# Altium project StratoChovy.PrjPcb (part 1 of 2)
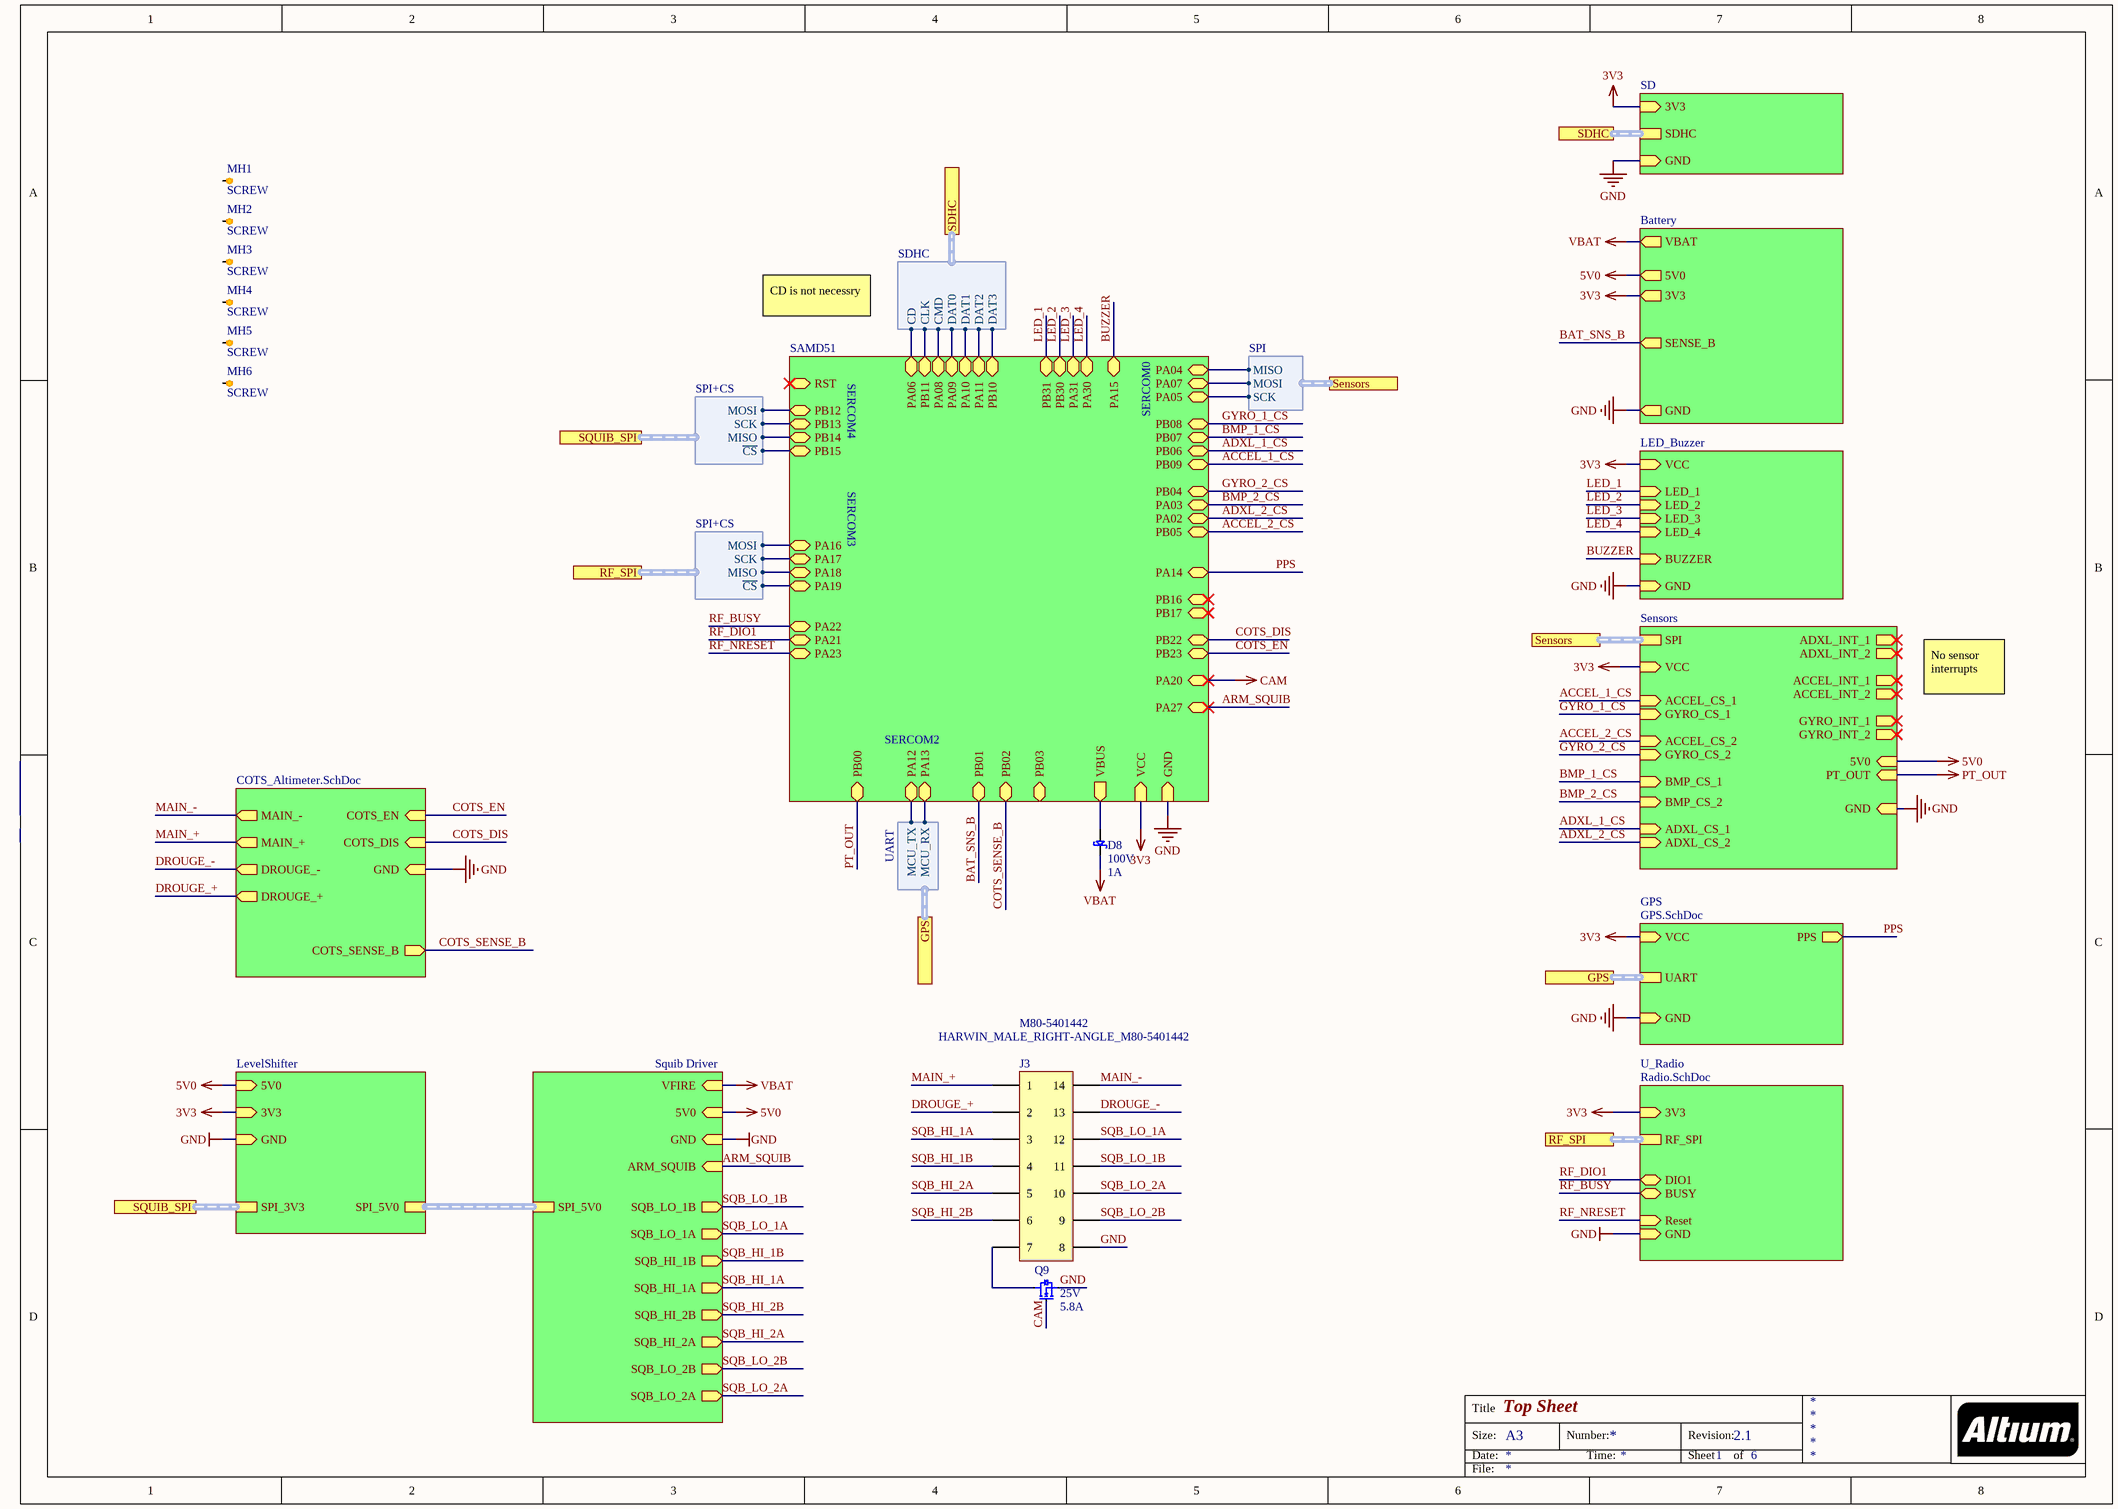
[diagram p0: StratoChovy.SchDoc]
prjEngineer1: Tim Vrakas; prjReviewDate: 2019-08-03; prjRevision: 1; prjTitle: ThunderGuppy
11 sheets, 166 parts. Net scope: strictly hierarchical (ports join the sheet entries above them; power ports are local).
Board files: Stratochovy2.PcbDoc, StratoChovy.PcbDoc
Sheets:
  StratoChovy.SchDoc
    Sensors = Sensors.SchDoc
    Battery = Battery_Management.SchDoc
    LED_Buzzer = Blink_Blink_Beep_Boop.SchDoc
    SAMD51 = SAMD51.SchDoc
    SD = SD.SchDoc
    GPS = GPS.SchDoc
    COTS_Altimeter = COTS_Altimeter.SchDoc
    U_Radio = Radio.SchDoc
    Squib Driver = MC33797.SchDoc
    LevelShifter = LevelShifter.SchDoc

## Sheet StratoChovy.SchDoc: Top Sheet
size A3; Author: Tim Vrakas; CompanyName: SSI; Revision: 2.1; SheetNumber: 1; SheetTotal: 6; DocumentName: Top Sheet

### Parts
D8  Voltage - DC Reverse (Vr) (Max): 100V  Current - Average Rectified (Io): 1A  [SMA]  (hidden comment: Diode_CD214A-B1100LF)
J3  HARWIN_MALE_RIGHT-ANGLE_M80-5401442  Manufacturer Part Number: M80-5401442  [HARWIN_M80-5401442]
MH1  SCREW  [SCREW_M3]
MH2  SCREW  [SCREW_M3]
MH3  SCREW  [SCREW_M3]
MH4  SCREW  [SCREW_M3]
MH5  SCREW  [SCREW_M3]
MH6  SCREW  [SCREW_M3]
Q9  Drain to Source Voltage (Vdss): 25V  Current - Continuous Drain (Id) @ 25° C: 5.8A  [3SOT23]  (hidden comment: NFET_IRFML8244TRPBF)

### Sub-sheets
Battery = Battery_Management: GND (out), 3V3 (out), VBAT (out), SENSE_B (out), 5V0 (out)
COTS_Altimeter = COTS_Altimeter.SchDoc: COTS_EN (in), COTS_DIS (in), GND (in), MAIN_- (out), MAIN_+ (out), DROUGE_- (out), DROUGE_+ (out), COTS_SENSE_B (out)
GPS = GPS.SchDoc: UART (harness UART), VCC (in), GND (in), PPS (out)
LED_Buzzer = Blink_Blink_Beep_Boop: LED_1 (in), LED_2 (in), LED_3 (in), LED_4 (in), BUZZER (in), GND (in), VCC (in)
LevelShifter = LevelShifter.SchDoc: SPI_3V3 (harness SPI+CS), SPI_5V0 (harness SPI+CS), 3V3 (in), 5V0 (in), GND (in)
SAMD51 = SAMD51.SchDoc: PA12 (bidir), PA13 (bidir), PA05 (bidir), PA07 (bidir), PA04 (bidir), PA06 (bidir), PB11 (bidir), PA08 (bidir), PA09 (bidir), PA10 (bidir), PA11 (bidir), PB10 (bidir), PB12 (bidir), PB13 (bidir), PA22 (bidir), PA23 (bidir), PA19 (bidir), PA17 (bidir), PA21 (bidir), PB08 (bidir), PB07 (bidir), PB06 (bidir), PB09 (bidir), PB04 (bidir), PA03 (bidir), PA02 (bidir), PB05 (bidir), PB30 (bidir), PA31 (bidir), PA30 (bidir), PB31 (bidir), PB16 (bidir), PA14 (bidir), PB17 (bidir), PB23 (bidir), PB22 (bidir), PB02 (bidir), PB03 (bidir), PA18 (bidir), GND (in), VCC (in), VBUS (out), PB14 (bidir), PB15 (bidir), PA15 (bidir), RST (bidir), PA16 (bidir), PB01 (bidir), PB00 (bidir), PA20 (bidir), PA27 (bidir)
SD = SD.SchDoc: SDHC (harness SDHC), GND (in), 3V3 (in)
Sensors = Sensors.SchDoc: SPI (harness SPI), GYRO_CS_1 (in), BMP_CS_1 (in), ADXL_CS_1 (in), ACCEL_CS_1 (in), ACCEL_INT_1 (out), ACCEL_INT_2 (out), ADXL_INT_1 (out), GYRO_INT_1 (out), GYRO_INT_2 (out), GND (in), VCC (in), GYRO_CS_2 (in), ACCEL_CS_2 (in), BMP_CS_2 (in), ADXL_CS_2 (in), ADXL_INT_2 (out), 5V0 (in), PT_OUT (in)
Squib Driver = MC33797.SchDoc: VFIRE (in), SPI_5V0 (harness SPI+CS), GND (in), 5V0 (in), SQB_HI_2B (out), SQB_LO_1B (out), SQB_LO_1A (out), SQB_HI_1B (out), SQB_HI_1A (out), SQB_HI_2A (out), SQB_LO_2B (out), SQB_LO_2A (out), ARM_SQUIB (in)
U_Radio = Radio.SchDoc: DIO1 (bidir), Reset (in), RF_SPI (harness SPI+CS), 3V3 (in), GND (in), BUSY (bidir)

### Ports
GPS (harness UART), RF_SPI (harness SPI+CS), SDHC (harness SDHC), Sensors (harness SPI), SQUIB_SPI (harness SPI+CS)

### Harnesses
UART: MCU_TX, MCU_RX
SPI: MISO, MOSI, SCK
SDHC: CD, CLK, CMD, DAT0, DAT1, DAT2, DAT3
SPI+CS: MOSI, SCK, MISO, ~{CS}

### Nets
3V3: sheet Sensors/VCC, sheet Battery/3V3, sheet LED_Buzzer/VCC, sheet SAMD51/VCC, sheet SD/3V3, sheet GPS/VCC, sheet U_Radio/3V3, sheet LevelShifter/3V3
5V0: sheet Sensors/5V0, sheet Battery/5V0, sheet Squib Driver/5V0, sheet LevelShifter/5V0
CAM: Q9.1 ; sheet SAMD51/PA20
GND: J3.8 Q9.2 ; sheet Sensors/GND, sheet Battery/GND, sheet LED_Buzzer/GND, sheet SAMD51/GND, sheet SD/GND, sheet GPS/GND, sheet COTS_Altimeter/GND, sheet U_Radio/GND, sheet Squib Driver/GND, sheet LevelShifter/GND
PT_OUT: sheet Sensors/PT_OUT, sheet SAMD51/PB00
VBAT: D8.2(Cathode) ; sheet Battery/VBAT, sheet Squib Driver/VFIRE
VBUS: D8.1(Anode) ; sheet SAMD51/VBUS
ACCEL_1_CS: sheet Sensors/ACCEL_CS_1, sheet SAMD51/PB09
ACCEL_2_CS: sheet Sensors/ACCEL_CS_2, sheet SAMD51/PB05
ADXL_1_CS: sheet Sensors/ADXL_CS_1, sheet SAMD51/PB06
ADXL_2_CS: sheet Sensors/ADXL_CS_2, sheet SAMD51/PA02
ARM_SQUIB: sheet SAMD51/PA27, sheet Squib Driver/ARM_SQUIB
BAT_SNS_B: sheet Battery/SENSE_B, sheet SAMD51/PB01
BMP_1_CS: sheet Sensors/BMP_CS_1, sheet SAMD51/PB07
BMP_2_CS: sheet Sensors/BMP_CS_2, sheet SAMD51/PA03
BUZZER: sheet LED_Buzzer/BUZZER, sheet SAMD51/PA15
COTS_DIS: sheet SAMD51/PB22, sheet COTS_Altimeter/COTS_DIS
COTS_EN: sheet SAMD51/PB23, sheet COTS_Altimeter/COTS_EN
COTS_SENSE_B: sheet SAMD51/PB02, sheet COTS_Altimeter/COTS_SENSE_B
DROUGE_+: J3.2 ; sheet COTS_Altimeter/DROUGE_+
DROUGE_-: J3.13 ; sheet COTS_Altimeter/DROUGE_-
GPS_RX: sheet SAMD51/PA12, port GPS.MCU_TX
GPS_TX: sheet SAMD51/PA13, port GPS.MCU_RX
GYRO_1_CS: sheet Sensors/GYRO_CS_1, sheet SAMD51/PB08
GYRO_2_CS: sheet Sensors/GYRO_CS_2, sheet SAMD51/PB04
LED_1: sheet LED_Buzzer/LED_1, sheet SAMD51/PB31
LED_2: sheet LED_Buzzer/LED_2, sheet SAMD51/PB30
LED_3: sheet LED_Buzzer/LED_3, sheet SAMD51/PA31
LED_4: sheet LED_Buzzer/LED_4, sheet SAMD51/PA30
MAIN_+: J3.1 ; sheet COTS_Altimeter/MAIN_+
MAIN_-: J3.14 ; sheet COTS_Altimeter/MAIN_-
MISO: sheet SAMD51/PA04, port Sensors.MISO
MOSI: sheet SAMD51/PA07, port Sensors.MOSI
PPS: sheet SAMD51/PA14, sheet GPS/PPS
RF_BUSY: sheet SAMD51/PA22, sheet U_Radio/BUSY
RF_DIO1: sheet SAMD51/PA21, sheet U_Radio/DIO1
RF_NRESET: sheet SAMD51/PA23, sheet U_Radio/Reset
SCK: sheet SAMD51/PA05, port Sensors.SCK
SD_CD: sheet SAMD51/PA06, port SDHC.CD
SD_CLK: sheet SAMD51/PB11, port SDHC.CLK
SD_CMD: sheet SAMD51/PA08, port SDHC.CMD
SD_DAT0: sheet SAMD51/PA09, port SDHC.DAT0
SD_DAT1: sheet SAMD51/PA10, port SDHC.DAT1
SD_DAT2: sheet SAMD51/PA11, port SDHC.DAT2
SD_DAT3: sheet SAMD51/PB10, port SDHC.DAT3
SQB_HI_1A: J3.3 ; sheet Squib Driver/SQB_HI_1A
SQB_HI_1B: J3.4 ; sheet Squib Driver/SQB_HI_1B
SQB_HI_2A: J3.5 ; sheet Squib Driver/SQB_HI_2A
SQB_HI_2B: J3.6 ; sheet Squib Driver/SQB_HI_2B
SQB_LO_1A: J3.12 ; sheet Squib Driver/SQB_LO_1A
SQB_LO_1B: J3.11 ; sheet Squib Driver/SQB_LO_1B
SQB_LO_2A: J3.10 ; sheet Squib Driver/SQB_LO_2A
SQB_LO_2B: J3.9 ; sheet Squib Driver/SQB_LO_2B
NetJ3_7: J3.7 Q9.3
NetU13_25: sheet SAMD51/PB12, port SQUIB_SPI.MOSI
NetU13_26: sheet SAMD51/PB13, port SQUIB_SPI.SCK
NetU13_27: sheet SAMD51/PB14, port SQUIB_SPI.MISO
NetU13_28: sheet SAMD51/PB15, port SQUIB_SPI.~{CS}
NetU13_35: sheet SAMD51/PA16, port RF_SPI.MOSI
NetU13_36: sheet SAMD51/PA17, port RF_SPI.SCK
NetU13_37: sheet SAMD51/PA18, port RF_SPI.MISO
NetU13_38: sheet SAMD51/PA19, port RF_SPI.~{CS}

Not connected (* = marked no-connect by the designer): MH1 1; MH2 1; MH3 1; MH4 1; MH5 1; MH6 1

### Buses and harness runs
harness port GPS = sheet GPS/UART
harness port RF_SPI = sheet U_Radio/RF_SPI
harness port SDHC = sheet SD/SDHC
harness port Sensors = sheet Sensors/SPI
harness port SQUIB_SPI = sheet LevelShifter/SPI_3V3
harness sheet LevelShifter/SPI_5V0 = sheet Squib Driver/SPI_5V0

### Notes on the sheet
- CD is not necessry
- SERCOM4
- SERCOM0
- SERCOM3
- No sensor interrupts
- SERCOM2
- Title
- Size:
- Date:
- A3
- Number:
- Time:
- Revision:
- Sheet
- of
- File:

### Library data of the parts
D8 = CMP-033-0060-1: Diode Schottky 100V 1A Surface Mount SMA (DO-214AC); Manufacturer: Bourns Inc.; Voltage - Forward (Vf) (Max) @ If: 790mV @ 1A; Current - Reverse Leakage @ Vr: 500µA @ 100V; Speed: Fast Recovery =< 500ns, > 200mA (Io); Capacitance @ Vr, F: 30pF @ 4V, 1MHz; Design Item ID: Diode_CD214A-B1100LF; Part Status: Active; Source: diode.SchLib; Stock 1: 21982; Manufacturer Part Number: CD214A-B1100LF; Diode Type: Schottky; Reverse Recovery Time (trr): -; Operating Temperature - Junction: -55°C ~ 125°C; RoHS: RoHS Compliant; Supplier Device Package: SMA (DO-214AC); Package / Case: DO-214AC, SMA; Packaging: Cut Tape (CT); ComponentLink1Description: http://www.bourns.com/docs/Product-Datasheets/CD214-B120_B1100.pdf; Mounting Type: Surface Mount; Pricing 1: 1=0.54, 10=0.42, 25=0.3544, 100=0.2888, 250=0.2392, 500=0.1976, 1000=0.148, 2500=0.136 (USD); ComponentLink1URL: http://www.bourns.com/docs/Product-Datasheets/CD214-B120_B1100.pdf
J3 = CMP-030-0115-1: 7+7 POS R/A MALE 3mm TAIL W/JS TIN; Manufacturer: Harwin; Pitch: 2mm; Number of poles: 14; Wire connection method: Solder; Number of arrays: 2; Source: connector.SchLib; ComponentLink1URL: https://datasheet.ciiva.com/11751/0900766b80d93463-11751065.pdf; ComponentLink2Description: https://datasheet.ciiva.com/733/m80-540-733786.pdf; Height: 6.05mm; Stock 1: 61; ComponentLink1Description: https://datasheet.ciiva.com/11751/0900766b80d93463-11751065.pdf; ComponentLink3URL: https://datasheet.ciiva.com/41451/001233329-da-01-en-stiftleiste-einbau-gewinkelt-m80-5401442-41451405.pdf; ComponentLink2URL: https://datasheet.ciiva.com/733/m80-540-733786.pdf; Design Item ID: HARWIN_MALE_RIGHT-ANGLE_M80-5401442; Pricing 1: 1=18.11, 10=16.81, 50=14.66, 100=12.93, 1000=11.81, 10000=11.81 (USD); ComponentLink3Description: https://datasheet.ciiva.com/41451/001233329-da-01-en-stiftleiste-einbau-gewinkelt-m80-5401442-41451405.pdf; Length: 24mm
MH1-MH6 = CMP-054-0000-1: Design Item ID: SCREW; Source: mechanical.SchLib
Q9 = CMP-078-0046-1: MOSFET N-CH 25V 5.8A SOT23; Manufacturer: International Rectifier; FET Type: MOSFET N-Channel, Metal Oxide; FET Feature: Logic Level Gate; Rds On (Max) @ Id, Vgs: 24 mOhm @ 5.8A, 10V; Vgs(th) (Max) @ Id: 2.35V @ 10µA; Gate Charge (Qg) @ Vgs: 5.4nC @ 10V; Input Capacitance (Ciss) @ Vds: 430pF @ 10V; Power - Max: 1.25W; Manufacturer Part Number: IRFML8244TRPBF; RoHS: RoHS Compliant; Stock 1: 13542; Pricing 1: 1=0.41, 10=0.23, 100=0.1491, 250=0.13548, 500=0.1219, 1000=0.11411 (USD); Mounting Type: Surface Mount; Package / Case: TO-236-3, SC-59, SOT-23-3; Supplier Device Package: SOT-23; Packaging: Cut Tape (CT); ComponentLink1URL: http://www.irf.com/product-info/datasheets/data/irfml8244pbf.pdf; ComponentLink1Description: Datasheet; Design Item ID: NFET_IRFML8244TRPBF; Source: transistor_fet.SchLib

## Sheet Sensors.SchDoc
size A3
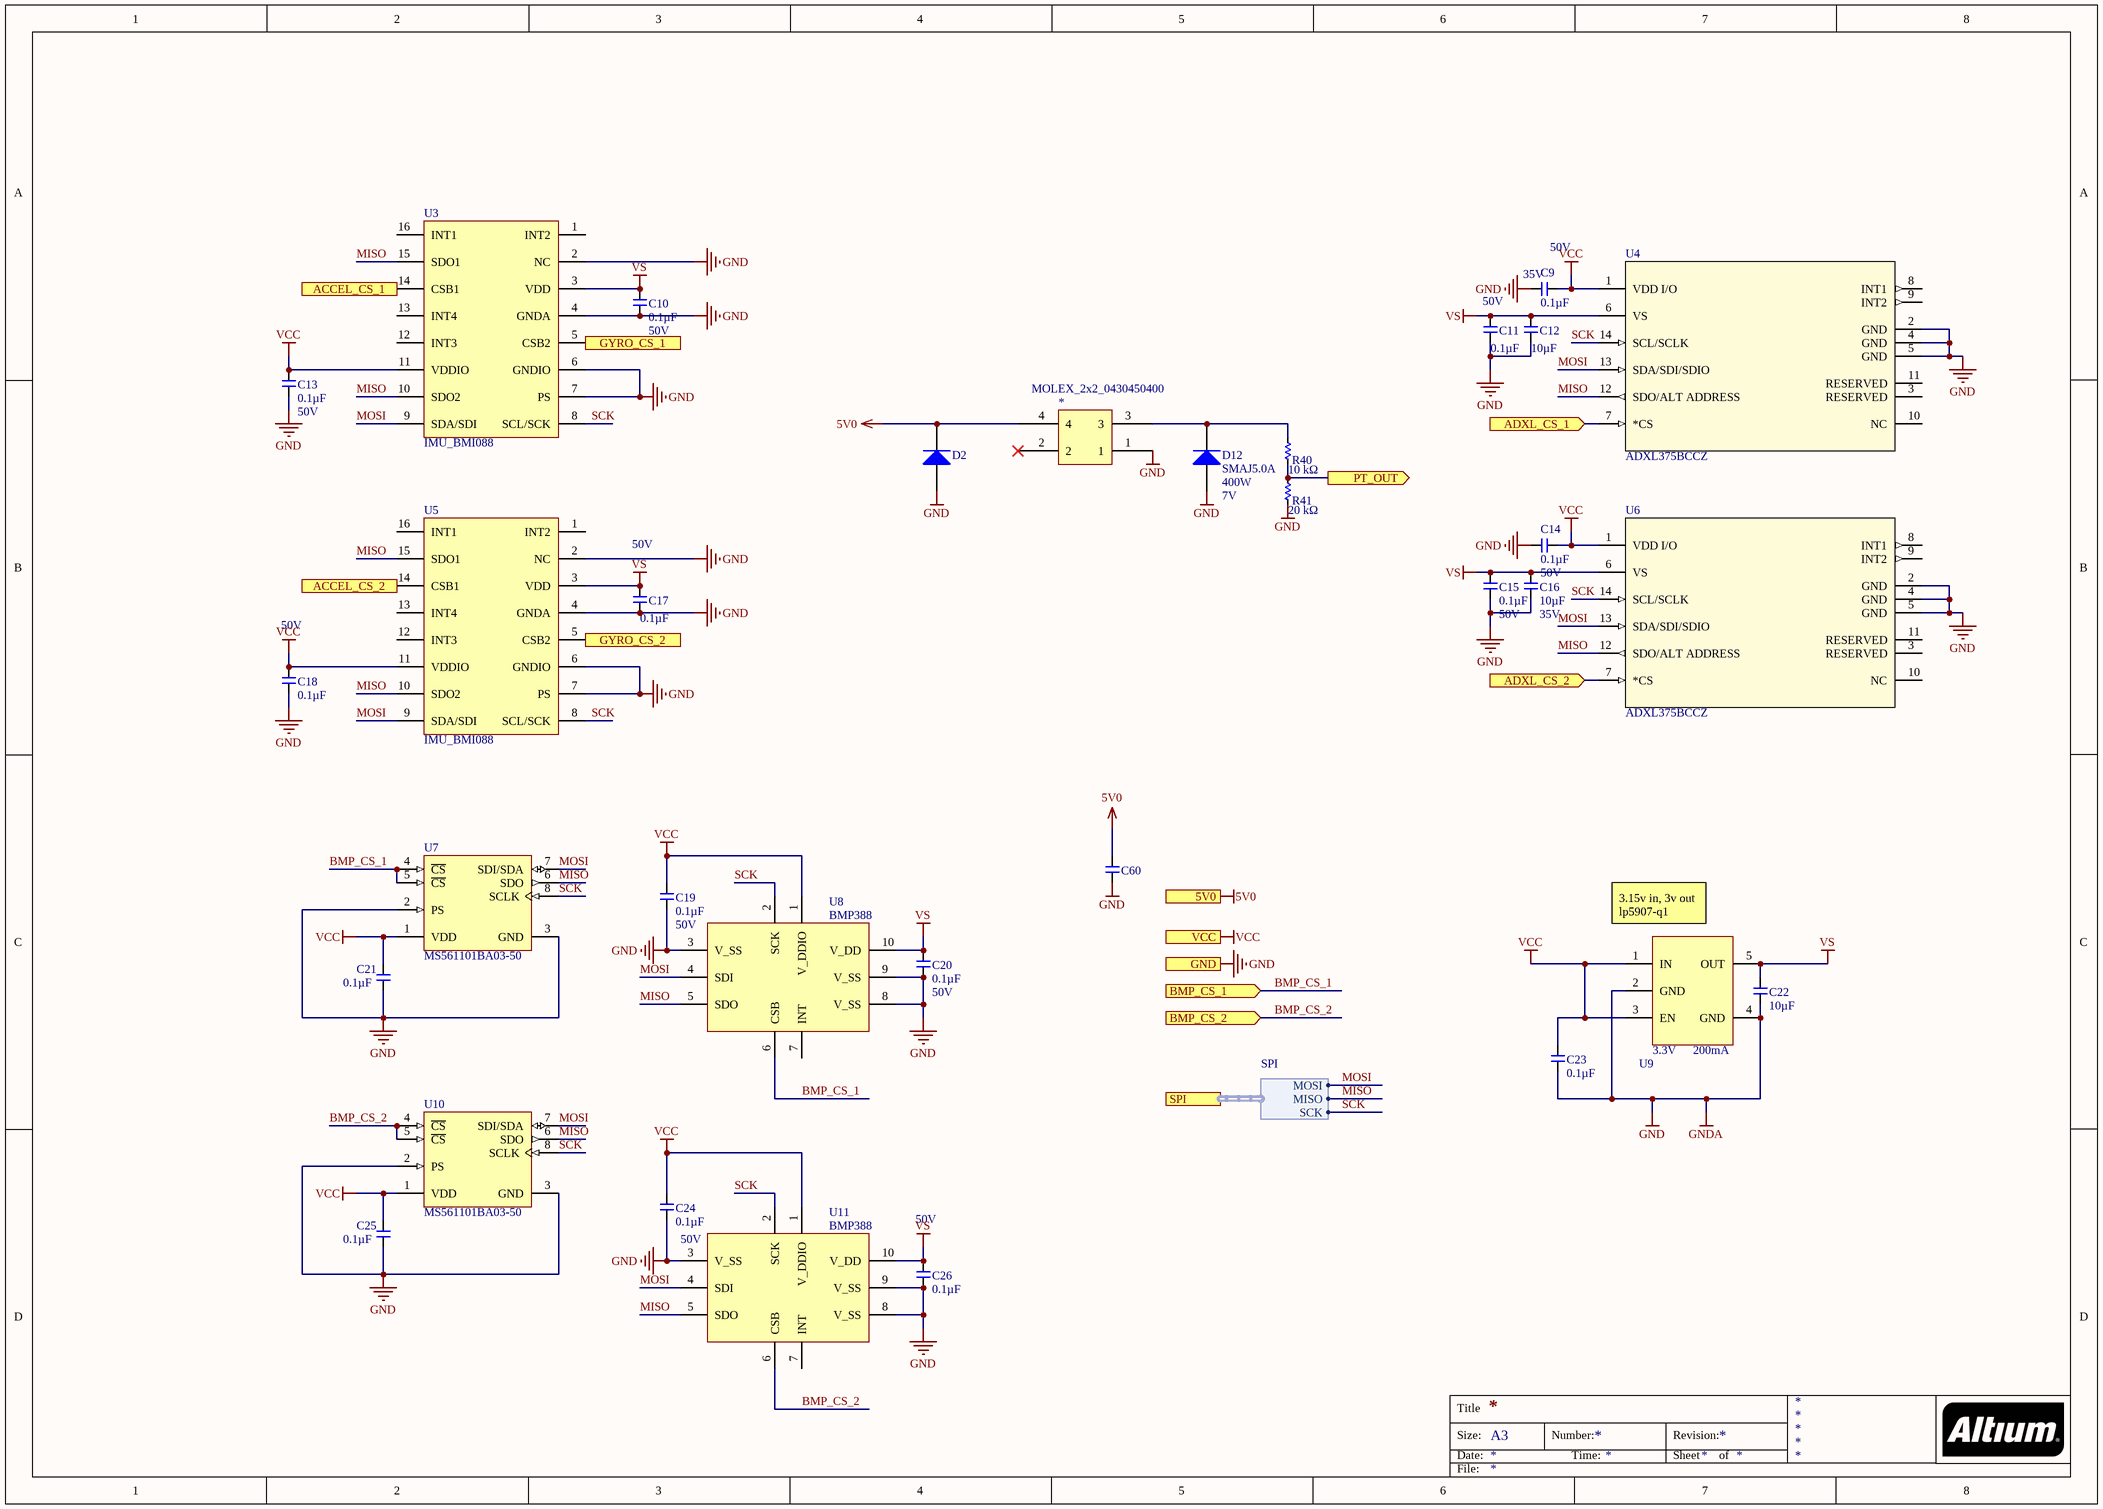
[diagram p1: Sensors.SchDoc]

### Parts
*  MOLEX_2x2_0430450400  [MOLEX_2x2_0430450400]
C9  Capacitance (shorthand): 0.1µF  Rated Voltage: 50V  [C0603]  (hidden comment: 490-1519-1-ND)
C10  Capacitance (shorthand): 0.1µF  Rated Voltage: 50V  [C0603]  (hidden comment: 490-1519-1-ND)
C11  Capacitance (shorthand): 0.1µF  Rated Voltage: 50V  [C0603]  (hidden comment: 490-1519-1-ND)
C12  Capacitance (shorthand): 10µF  Rated Voltage: 35V  [C0603]  (hidden comment: 490-13248-1-ND)
C13  Capacitance (shorthand): 0.1µF  Rated Voltage: 50V  [C0603]  (hidden comment: 490-1519-1-ND)
C14  Capacitance (shorthand): 0.1µF  Rated Voltage: 50V  [C0603]  (hidden comment: 490-1519-1-ND)
C15  Capacitance (shorthand): 0.1µF  Rated Voltage: 50V  [C0603]  (hidden comment: 490-1519-1-ND)
C16  Capacitance (shorthand): 10µF  Rated Voltage: 35V  [C0603]  (hidden comment: 490-13248-1-ND)
C17  Capacitance (shorthand): 0.1µF  Rated Voltage: 50V  [C0603]  (hidden comment: 490-1519-1-ND)
C18  Capacitance (shorthand): 0.1µF  Rated Voltage: 50V  [C0603]  (hidden comment: 490-1519-1-ND)
C19  Capacitance (shorthand): 0.1µF  Rated Voltage: 50V  [C0603]  (hidden comment: 490-1519-1-ND)
C20  Capacitance (shorthand): 0.1µF  Rated Voltage: 50V  [C0603]  (hidden comment: 490-1519-1-ND)
C21  Capacitance (shorthand): 0.1µF  [C0603]  (hidden comment: 490-1519-1-ND)
C22  Capacitance (shorthand): 10µF  [C0603]  (hidden comment: 490-13248-1-ND)
C23  Capacitance (shorthand): 0.1µF  [C0603]  (hidden comment: 490-1519-1-ND)
C24  Capacitance (shorthand): 0.1µF  Rated Voltage: 50V  [C0603]  (hidden comment: 490-1519-1-ND)
C25  Capacitance (shorthand): 0.1µF  [C0603]  (hidden comment: 490-1519-1-ND)
C26  Capacitance (shorthand): 0.1µF  Rated Voltage: 50V  [C0603]  (hidden comment: 490-1519-1-ND)
C60  490-1519-1-ND  [C0603]  (value not drawn)
D2  SMAJ5.0A  [BOUR-SMA-2_V]  (value not drawn)
D12  SMAJ5.0A  Max Power Dissipation: 400W  Breakdown Voltage: 7V  [BOUR-SMA-2_V]
R40  Resistance: 10 kΩ  [R0603]  (hidden comment: 311-10.0KHRCT-ND)
R41  Resistance: 20 kΩ  [R0603]  (hidden comment: 311-20.0KHRCT-ND)
U3  IMU_BMI088  [BMI088]
U4  ADXL375BCCZ  [LGA_CC-14-1]
U5  IMU_BMI088  [BMI088]
U6  ADXL375BCCZ  [LGA_CC-14-1]
U7  MS561101BA03-50  [MSI-MS561101BA03-50-8_V]
U8  BMP388  [8 pin LGA]
U9  Voltage - Output: 3.3V  Current - Output: 200mA  [5SOT23]  (hidden comment: LDO_TLV70033QDDCRQ1)
U10  MS561101BA03-50  [MSI-MS561101BA03-50-8_V]
U11  BMP388  [8 pin LGA]

### Ports
5V0 (in), ACCEL_CS_1 (in), ACCEL_CS_2 (in), ADXL_CS_1 (in), ADXL_CS_2 (in), BMP_CS_1 (in), BMP_CS_2 (in), GND (in), GYRO_CS_1 (in), GYRO_CS_2 (in), PT_OUT (out), SPI (harness SPI), VCC (in)

### Harnesses
SPI: MISO, MOSI, SCK

### Nets
5V0: *.4 C60.1 D2.2(K) ; port 5V0
GND: *.1 C9.2 C10.2 C11.1 C12.2 C13.2 C14.2 C15.1 C16.2 C17.2 C18.2 C19.2 C20.2 C21.2 C22.2 C23.2 C24.2 C25.2 C26.2 C60.2 D2.1(A) D12.1(A) R41.1 U3.2(NC) U3.4(GNDA) U3.6(GNDIO) U3.7(PS) U4.2(GND) U4.4(GND) U4.5(GND) U5.2(NC) U5.4(GNDA) U5.6(GNDIO) U5.7(PS) U6.2(GND) U6.4(GND) U6.5(GND) U7.2(PS) U7.3(GND) U8.3(V_SS) U8.8(V_SS) U8.9(V_SS) U9.2(GND) U9.4(GND) U10.2(PS) U10.3(GND) U11.3(V_SS) U11.8(V_SS) U11.9(V_SS) ; port GND  [also labelled GNDA]
PT_OUT: R40.1 R41.2 ; port PT_OUT
VCC: C9.1 C13.1 C14.1 C18.1 C19.1 C21.1 C23.1 C24.1 C25.1 U3.11(VDDIO) U4.1(VDD_I/O) U5.11(VDDIO) U6.1(VDD_I/O) U7.1(VDD) U8.1(V_DDIO) U9.1(IN) U9.3(EN) U10.1(VDD) U11.1(V_DDIO) ; port VCC  [project net 3V3]
VS: C10.1 C11.2 C12.1 C15.2 C16.1 C17.1 C20.1 C22.1 C26.1 U3.3(VDD) U4.6(VS) U5.3(VDD) U6.6(VS) U8.10(V_DD) U9.5(OUT) U11.10(V_DD)
ACCEL_1_CS: U3.14(CSB1) ; port ACCEL_CS_1
ACCEL_2_CS: U5.14(CSB1) ; port ACCEL_CS_2
ADXL_1_CS: U4.7(*CS) ; port ADXL_CS_1
ADXL_2_CS: U6.7(*CS) ; port ADXL_CS_2
BMP_CS_1: U7.4(~{CS}) U7.5(~{CS}) U8.6(CSB) ; port BMP_CS_1  [project net BMP_1_CS]
BMP_CS_2: U10.4(~{CS}) U10.5(~{CS}) U11.6(CSB) ; port BMP_CS_2  [project net BMP_2_CS]
GYRO_1_CS: U3.5(CSB2) ; port GYRO_CS_1
GYRO_2_CS: U5.5(CSB2) ; port GYRO_CS_2
MISO: U3.10(SDO2) U3.15(SDO1) U4.12(SDO/ALT_ADDRESS) U5.10(SDO2) U5.15(SDO1) U6.12(SDO/ALT_ADDRESS) U7.6(SDO) U8.5(SDO) U10.6(SDO) U11.5(SDO) ; port SPI.MISO
MOSI: U3.9(SDA/SDI) U4.13(SDA/SDI/SDIO) U5.9(SDA/SDI) U6.13(SDA/SDI/SDIO) U7.7(SDI/SDA) U8.4(SDI) U10.7(SDI/SDA) U11.4(SDI) ; port SPI.MOSI
SCK: U3.8(SCL/SCK) U4.14(SCL/SCLK) U5.8(SCL/SCK) U6.14(SCL/SCLK) U7.8(SCLK) U8.2(SCK) U10.8(SCLK) U11.2(SCK) ; port SPI.SCK
Net*_3: *.3 D12.2(K) R40.2

Not connected (* = marked no-connect by the designer): * 2*; U3 1(INT2) 12(INT3) 13(INT4) 16(INT1); U4 3(RESERVED) 8(INT1) 9(INT2) 10(NC) 11(RESERVED); U5 1(INT2) 12(INT3) 13(INT4) 16(INT1); U6 3(RESERVED) 8(INT1) 9(INT2) 10(NC) 11(RESERVED); U8 7(INT); U11 7(INT)

### Notes on the sheet
- (near U9) 3.15v in, 3v out
  lp5907-q1
- Title
- Size:
- Date:
- A3
- Number:
- Time:
- Revision:
- Sheet
- of
- File:

### Library data of the parts
* = CMP-030-0039-1: MICROFIT CONN HEADER R/A 4POS 3MM; Design Item ID: MOLEX_2x2_0430450400; Source: connector.SchLib
C9-C11 C13-C15 C17-C21 C23-C26 C60 = CMP-119-0065-1: CAP CER 0603 0.1µF X7R 50V 10%; Manufacturer: Murata Electronics North America; Capacitance - pF (Machine readable): #NAME?; Dielectric: X7R
  C21 C25: Rated Voltage: 50V
  C60: Capacitance (shorthand): 0.1µF; Rated Voltage: 50V
C12 C16 C22 = CMP-119-0071-1: CAP CER 10UF 35V X5R 0603 20%; Manufacturer: Murata Electronics North America; Capacitance - pF (Machine readable): #NAME?; Dielectric: X5R
D2 = CMP-00017-1: BOURNS - SMAJ5.0A - TVS Diode, SMAJ Series, Unidirectional, 5 V, 9.2 V, DO-214AC (SMA), 2 Pins; Min Breakdown Voltage: 6.4V; ESD Protection: Yes; Test Current: 10mA; Clamping Voltage: 9.2V; Leakage Current: 800uA; Max Breakdown Voltage: 7V; Number of Unidirectional Channels: 1; Operating Supply Voltage: 3.5V; Peak Pulse Current: 43.5A; Power Line Protection: No; Peak Pulse Power: 400W; Reverse Standoff Voltage: 5V; Diode Type: ZENER; Element Configuration: Single; Max Surge Current: 40A; Height: 2.42mm; Case/Package: DO-214AC; Max Reverse Leakage Current: 800uA; Packaging: Tape and Reel; REACH SVHC: No SVHC; Direction: Unidirectional; Series: SMAJ; Radiation Hardening: No; Mount: Surface Mount; Max Operating Temperature: 150°C; Package Quantity: 1; Width: 2.92mm; Reverse Breakdown Voltage: 6.4V; Number of Channels: 1; Polarity: Unidirectional; Min Operating Temperature: -55°C; Length: 4.57mm; Resistor Type: Zener; Max Power Dissipation: 400W; Number of Pins: 2; Breakdown Voltage: 7V; Number of Elements: 1; Termination: SMD/SMT
D12 = CMP-00017-1: BOURNS - SMAJ5.0A - TVS Diode, SMAJ Series, Unidirectional, 5 V, 9.2 V, DO-214AC (SMA), 2 Pins; Min Breakdown Voltage: 6.4V; ESD Protection: Yes; Test Current: 10mA; Clamping Voltage: 9.2V; Leakage Current: 800uA; Number of Unidirectional Channels: 1; Operating Supply Voltage: 3.5V; Peak Pulse Current: 43.5A; Power Line Protection: No; Reverse Standoff Voltage: 5V; Diode Type: ZENER; Element Configuration: Single; Max Surge Current: 40A; Height: 2.42mm; Case/Package: DO-214AC; Max Breakdown Voltage: 7V; Max Reverse Leakage Current: 800uA; Packaging: Tape and Reel; REACH SVHC: No SVHC; Direction: Unidirectional; Series: SMAJ; Radiation Hardening: No; Mount: Surface Mount; Max Operating Temperature: 150°C; Peak Pulse Power: 400W; Package Quantity: 1; Width: 2.92mm; Reverse Breakdown Voltage: 6.4V; Number of Channels: 1; Polarity: Unidirectional; Min Operating Temperature: -55°C; Length: 4.57mm; Resistor Type: Zener; Number of Pins: 2; Number of Elements: 1; Termination: SMD/SMT
R40 = CMP-126-0273-2: RES SMD 10K OHM 1% 1/10W 0603; Manufacturer: Yageo; Manufacturer Part Number: RC0603FR-0710KL; Power (Watts): 0.1W, 1/10W; Resistance (Sortable): 10000; Temperature Coefficient: ±100ppm/°C; Tolerance: ±1%; Datasheets: http://www.yageo.com/documents/recent/PYu-RC_Group_51_RoHS_L_9.pdf; Image: //media.digikey.com/Renders/Yageo%20Renders/0603-(1608-Metric).jpg; Operating Temperature: -55°C ~ 155°C
R41 = CMP-126-0304-2: RES SMD 20K OHM 1% 1/10W 0603; Manufacturer Part Number: RC0603FR-0720KL; Manufacturer: Yageo; Temperature Coefficient: ±100ppm/°C; Power (Watts): 0.1W, 1/10W; Resistance (Sortable): 20000; Datasheets: http://www.yageo.com/documents/recent/PYu-RC_Group_51_RoHS_L_9.pdf; Operating Temperature: -55°C ~ 155°C; Image: //media.digikey.com/Renders/Yageo%20Renders/0603-(1608-Metric).jpg; Tolerance: ±1%
U3 U5 = CMP-074-0017-1: Bosch BMI088; Design Item ID: IMU_BMI088; Source: sensor.SchLib
U4 U6 = CMP-074-0018-1: 200G Accelcerometer; Manufacturer: Analog Devices; Manufacturer Part Number: ADXL375BCCZ-RL7; Bandwidth: 1kHz; Interface: I2C,SPI; Nominal Supply Current: 145uA; -3db Bandwidth: 1.6kHz; Output Type: Digital; Axis: X, Y, Z; Sensitivity: 20.5LSB/g; Operating Supply Voltage: 3.6V; Stock 1: 3410; Pricing 1: 1=10.9, 10=10.021, 100=8.463, 500=7.5284 (USD); Mount: Surface Mount; Number of Pins: 14; Min Operating Temperature: -40°C; Max Operating Temperature: 85°C; Package Quantity: 1; Operating Supply Current: 145uA; Lead Free: Contains Lead; Design Item ID: ADXL375BCCZ; Source: sensor.SchLib
U7 U10 = CMP-00025-1: Pressure Sensor 1.44V to 3.6V 0.01bar to 1.2bar Absolute 8-Pin QFN T/R; Operating Supply Current: 12.5uA; Output Type: Digital; Resolution: 24b; Operating Supply Voltage: 3V; Interface: I2C,SPI; Min Supply Voltage: 1.8V; Packaging: Tape and Reel; Number of Pins: 8; Case/Package: QFN; Nominal Supply Current: 12.5uA; Min Operating Temperature: -40°C; REACH SVHC: No SVHC; Max Supply Voltage: 3.6V; RoHS Compliant: Yes; Output Voltage: 3.6V; Pressure Type: Absolute; Radiation Hardening: No; Max Operating Temperature: 85°C; Package Quantity: 3600; Mount: Surface Mount
U8 U11 = CMP-074-0001-1: SENSOR PRESSURE ABS; Manufacturer: Bosch Sensortec; Manufacturer Part Number: BMP388; Stock 1: 46050; Pricing 1: 1=3.93, 5=3.466, 10=3.061, 25=2.4832, 50=2.1946, 100=2.1368, 500=1.7903, 1000=1.6748, 5000=1.5593 (USD); ComponentLink1URL: https://ae-bst.resource.bosch.com/media/_tech/media/product_flyer/BST-BMP388-FL000-00.pdf; ComponentLink1Description: https://ae-bst.resource.bosch.com/media/_tech/media/product_flyer/BST-BMP388-FL000-00.pdf; Design Item ID: BMP388; Source: sensor.SchLib
U9 = CMP-048-0071-1: IC REG LDO 3.3V .2A SOT23-5; Manufacturer: Texas Instruments; Number of Regulators: 1; Regulator Topology: Positive Fixed; Current - Limit (Min): 220mA; Voltage - Input: Up to 5.5V; Manufacturer Part Number: TLV70033QDDCRQ1; Stock 1: 889; Pricing 1: 1=0.58, 10=0.507, 25=0.444, 100=0.1661, 250=0.16296, 500=0.1599, 750=0.15683 (USD); RoHS: RoHS Compliant; Packaging: Cut Tape (CT); ComponentLink1URL: http://www.ti.com/lit/ds/symlink/tlv70033-q1.pdf; ComponentLink1Description: Datasheet; Voltage - Dropout (Typical): -; Operating Temperature: -40°C ~ 125°C; Mounting Type: Surface Mount; Package / Case: SOT-23-5 Thin, TSOT-23-5; Supplier Device Package: SOT-5; Design Item ID: LDO_TLV70033QDDCRQ1; Source: ic_pmic.SchLib

## Sheet Battery_Management.SchDoc: Battery Management
size A3; SheetNumber: 4; SheetTotal: 6
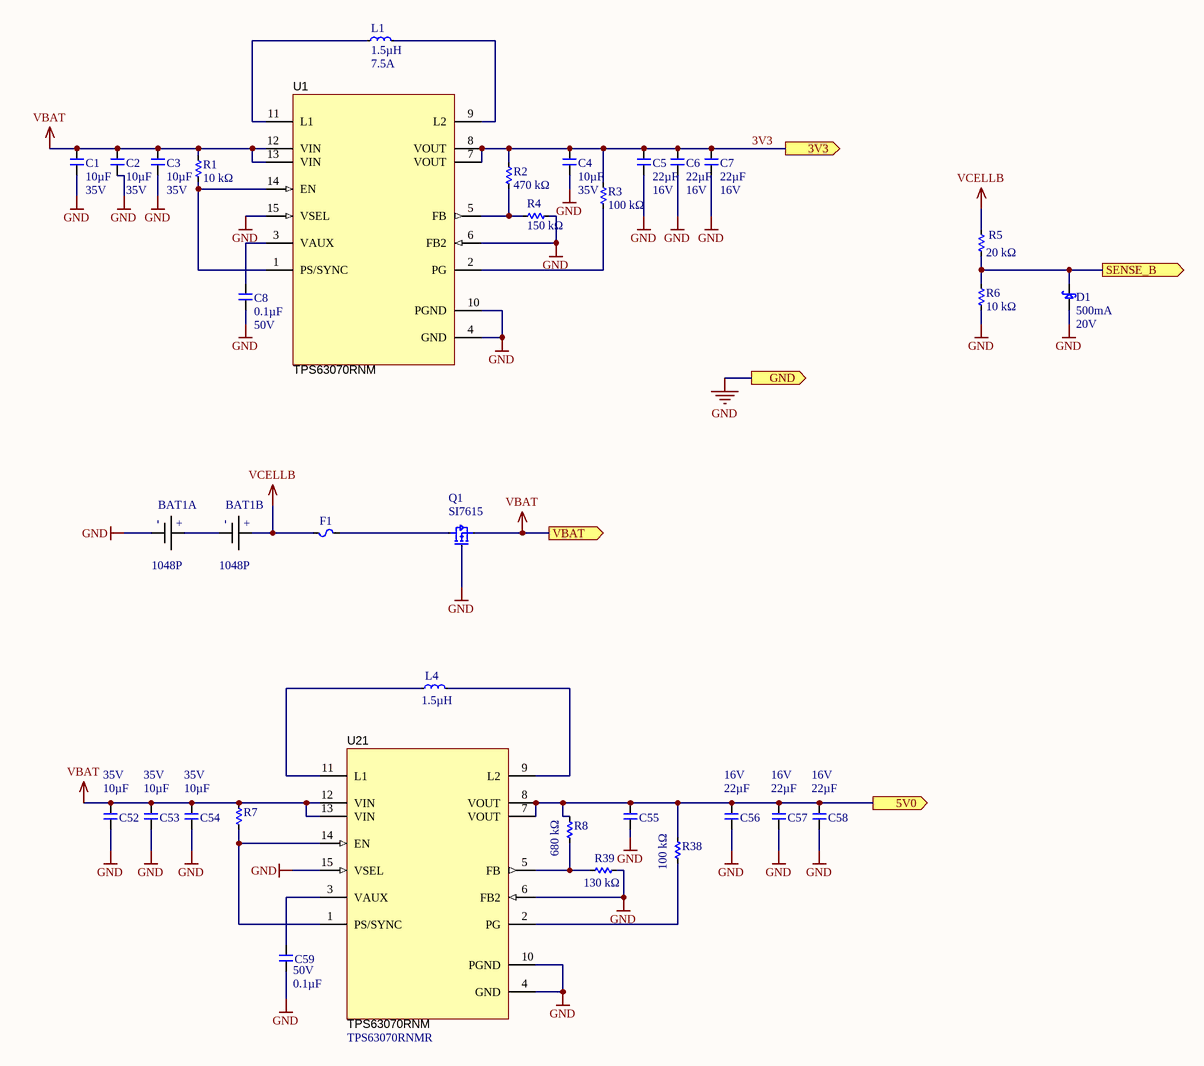
[diagram p2: Battery_Management.SchDoc]

### Parts
BAT1  Manufacturer Part Number: 1048P  [BATT_18650_KEYSTONE_1048]  (hidden comment: BATT_Clip_Li-Ion_2x)  (parts A,B of 2)
C1  Capacitance (shorthand): 10µF  Rated Voltage: 35V  [C0603]  (hidden comment: 490-13248-1-ND)
C2  Capacitance (shorthand): 10µF  Rated Voltage: 35V  [C0603]  (hidden comment: 490-13248-1-ND)
C3  Capacitance (shorthand): 10µF  Rated Voltage: 35V  [C0603]  (hidden comment: 490-13248-1-ND)
C4  Capacitance (shorthand): 10µF  Rated Voltage: 35V  [C0603]  (hidden comment: 490-13248-1-ND)
C5  Capacitance (shorthand): 22µF  Rated Voltage: 16V  [C0603]  (hidden comment: 1276-7076-1-ND)
C6  Capacitance (shorthand): 22µF  Rated Voltage: 16V  [C0603]  (hidden comment: 1276-7076-1-ND)
C7  Capacitance (shorthand): 22µF  Rated Voltage: 16V  [C0603]  (hidden comment: 1276-7076-1-ND)
C8  Capacitance (shorthand): 0.1µF  Rated Voltage: 50V  [C0603]  (hidden comment: 490-1519-1-ND)
C52  Rated Voltage: 35V  Capacitance (shorthand): 10µF  [C0603]  (hidden comment: 490-13248-1-ND)
C53  Rated Voltage: 35V  Capacitance (shorthand): 10µF  [C0603]  (hidden comment: 490-13248-1-ND)
C54  Rated Voltage: 35V  Capacitance (shorthand): 10µF  [C0603]  (hidden comment: 490-13248-1-ND)
C55  490-13248-1-ND  [C0603]  (value not drawn)
C56  Rated Voltage: 16V  Capacitance (shorthand): 22µF  [C0603]  (hidden comment: 1276-7076-1-ND)
C57  Rated Voltage: 16V  Capacitance (shorthand): 22µF  [C0603]  (hidden comment: 1276-7076-1-ND)
C58  Rated Voltage: 16V  Capacitance (shorthand): 22µF  [C0603]  (hidden comment: 1276-7076-1-ND)
C59  Capacitance (shorthand): 0.1µF  Rated Voltage: 50V  [C0603]  (hidden comment: 490-1519-1-ND)
D1  Current - Average Rectified (Io): 500mA  Voltage - DC Reverse (Vr) (Max): 20V  [SOD123]  (hidden comment: SCHOTTKY_MBR0520L)
F1  __template_fuse  [R1206]  (value not drawn)
L1  Inductance: 1.5µH  Current Rating: 7.5A  [SMD5230]  (hidden comment: Symbol)
L4  Inductance: 1.5µH  [SMD5230]  (hidden comment: IND_IHLP2020CZER1R5M11)
Q1  SI7615  [POWERPAK_1212-8_SINGLE]
R1  Resistance: 10 kΩ  [R0603]  (hidden comment: 311-10.0KHRCT-ND)
R2  Resistance: 470 kΩ  [R0603]  (hidden comment: 311-470KHRCT-ND)
R3  Resistance: 100 kΩ  [R0603]  (hidden comment: 311-100KHRCT-ND)
R4  Resistance: 150 kΩ  [R0603]  (hidden comment: 311-150KHRCT-ND)
R5  Resistance: 20 kΩ  [R0603]  (hidden comment: 311-20.0KHRCT-ND)
R6  Resistance: 10 kΩ  [R0603]  (hidden comment: 311-10.0KHRCT-ND)
R7  311-10.0KHRCT-ND  [R0603]  (value not drawn)
R8  Resistance: 680 kΩ  [R0603]  (hidden comment: 311-680KHRCT-ND)
R38  Resistance: 100 kΩ  [R0603]  (hidden comment: 311-100KHRCT-ND)
R39  Resistance: 130 kΩ  [R0603]  (hidden comment: 311-130KHRCT-ND)
U1  TPS63070RNM  [TPS63070]
U21  TPS63070RNM  Manufacturer Part Number: TPS63070RNMR  [TPS63070]

### Ports
3V3 (out), 5V0 (out), GND (out), SENSE_B (out), VBAT (out)

### Nets
3V3: C4.1 C5.1 C6.1 C7.1 R2.2 R3.2 U1.7(VOUT) U1.8(VOUT) ; port 3V3
5V0: C55.1 C56.1 C57.1 C58.1 R8.2 R38.2 U21.7(VOUT) U21.8(VOUT) ; port 5V0
GND: BAT1.CELL1- C1.2 C2.2 C3.2 C4.2 C5.2 C6.2 C7.2 C8.2 C52.2 C53.2 C54.2 C55.2 C56.2 C57.2 C58.2 C59.2 D1.1 Q1.4 R4.2 R6.1 R39.2 U1.4(GND) U1.6(FB2) U1.10(PGND) U1.15(VSEL) U21.4(GND) U21.6(FB2) U21.10(PGND) U21.15(VSEL) ; port GND
VBAT: C1.1 C2.1 C3.1 C52.1 C53.1 C54.1 Q1.1 R1.2 R7.2 U1.12(VIN) U1.13(VIN) U21.12(VIN) U21.13(VIN) ; port VBAT
VCELLB: BAT1.CELL2+ F1.1 R5.2
BAT_SNS_B: D1.2 R5.1 R6.2 ; port SENSE_B
NetBAT1_CELL1+: BAT1.CELL1+ BAT1.CELL2-
NetC8_1: C8.1 U1.3(VAUX)
NetC59_1: C59.1 U21.3(VAUX)
NetF1_2: F1.2 Q1.5
NetL1_1: L1.1 U1.11(L1)
NetL1_2: L1.2 U1.9(L2)
NetL4_1: L4.1 U21.11(L1)
NetL4_2: L4.2 U21.9(L2)
NetR1_1: R1.1 U1.1(PS/SYNC) U1.14(EN)
NetR2_1: R2.1 R4.1 U1.5(FB)
NetR3_1: R3.1 U1.2(PG)
NetR7_1: R7.1 U21.1(PS/SYNC) U21.14(EN)
NetR8_1: R8.1 R39.1 U21.5(FB)
NetR38_1: R38.1 U21.2(PG)

### Notes on the sheet
- Title
- Size:
- Date:
- A3
- Number:
- Time:
- Revision:
- Sheet
- of
- File:
- (in symbol CMP-030-0028-3, part A) +
- (in symbol CMP-030-0028-3, part B) +

### Library data of the parts
BAT1 = CMP-030-0028-3: Dual Lithium Ion Cell Holder; Manufacturer: Keystone Electronics; Number of Cells: 2; Battery Type, Function: Cylindrical, Holder; Battery Cell Size: 18650; Style: Holder (Open); ComponentLink1URL: http://www.keyelco.com/product-pdf.cfm?p=13959; Battery Series: -; RoHS: RoHS Compliant; Height Above Board: 0.585" (14.86mm); Design Item ID: BATT_Clip_Li-Ion_2x; Mounting Type: PCB, Surface Mount; Termination Style: SMD (SMT) Tab; Source: connector.SchLib; Stock 1: 759; Pricing 1: 1=4.81, 10=4.007, 50=3.506, 100=3.339, 250=2.92164, 500=2.83816, 1000=2.42078, 2500=2.25382, 5000=2.24047 (USD); ComponentLink1Description: http://www.keyelco.com/product-pdf.cfm?p=13959; Operating Temperature: -50°C ~ 145°C
C1-C4 C52-C54 = CMP-119-0071-1: as C12 on sheet Sensors; Dielectric: X5R
C5-C7 C56-C58 = CMP-119-0072-1: CAP CER 22UF 16V X5R 0603 20%; Manufacturer: Samsung Electro-Mechanics; Capacitance - pF (Machine readable): #NAME?; Dielectric: X5R
C8 C59 = CMP-119-0065-1: as C9 on sheet Sensors; Dielectric: X7R
C55 = CMP-119-0071-1: CAP CER 10UF 35V X5R 0603 20%; Manufacturer: Murata Electronics North America; Capacitance - pF (Machine readable): #NAME?; Capacitance (shorthand): 10µF; Rated Voltage: 35V; Dielectric: X5R
D1 = CMP-033-0037-1: DIODE SCHOTTKY 0.5A 20V SOD-123; Manufacturer: Fairchild Semiconductor; Speed: Fast Recovery =< 500ns, > 200mA (Io); Current - Reverse Leakage @ Vr: 250µA @ 20V; Voltage - Forward (Vf) (Max) @ If: 385mV @ 500mA; Manufacturer Part Number: MBR0520L; RoHS: RoHS Compliant; Stock 1: 217232; Pricing 1: 1=0.63, 10=0.43, 100=0.2024, 250=0.1442, 500=0.11006, 750=0.08603, 1000=0.0759 (USD); Diode Type: Schottky; Reverse Recovery Time (trr): -; Capacitance @ Vr, F: -; Mounting Type: Surface Mount; Package / Case: SOD-123; Supplier Device Package: SOD-123; Packaging: Cut Tape (CT); ComponentLink1URL: http://www.fairchildsemi.com/ds/MB/MBR0520L.pdf; ComponentLink1Description: Datasheet; Design Item ID: SCHOTTKY_MBR0520L; Source: diode.SchLib
F1 = CMP-035-0003-1: Source: fuse.SchLib; Design Item ID: __template_fuse
L1 = CMP-052-0036-1: INDUCTOR POWER 1.5UH 7.5A SMD; Manufacturer: Vishay Dale; Manufacturer Part Number: IHLP2020CZER1R5M11; Current - Saturation: 7A; Tolerance: ±20%; Shielding: Shielded; DC Resistance (DCR): 18.5 mOhm Max; Frequency - Test: 100kHz; RoHS: RoHS Compliant; Stock 1: 17936; Pricing 1: 1=2.29, 10=1.86, 100=1.55, 500=1.24, 1000=1.116 (USD); Material - Core: -; Q @ Freq: -; Frequency - Self Resonant: -; Operating Temperature: -55°C ~ 125°C; Package / Case: Non Standard; Size / Dimension: 0.216" L x 0.204" W x 0.118" H (5.49mm x 5.18mm x 3.00mm); Mounting Type: Surface Mount; Packaging: Cut Tape (CT); ComponentLink1URL: http://www.vishay.com/docs/34260/lp20cz11.pdf; ComponentLink1Description: Datasheet; Design Item ID: IND_IHLP2020CZER1R5M11; Source: inductor.SchLib
L4 = CMP-052-0036-1: INDUCTOR POWER 1.5UH 7.5A SMD; Manufacturer: Vishay Dale; DC Resistance (DCR): 18.5 mOhm Max; Tolerance: ±20%; Current - Saturation: 7A; Frequency - Test: 100kHz; Shielding: Shielded; Operating Temperature: -55°C ~ 125°C; Design Item ID: IND_IHLP2020CZER1R5M11; Pricing 1: 1=2.29, 10=1.86, 100=1.55, 500=1.24, 1000=1.116 (USD); Frequency - Self Resonant: -; ComponentLink1URL: http://www.vishay.com/docs/34260/lp20cz11.pdf; Mounting Type: Surface Mount; Packaging: Cut Tape (CT); Stock 1: 17936; Q @ Freq: -; Current Rating: 7.5A; ComponentLink1Description: Datasheet; Source: inductor.SchLib; Manufacturer Part Number: IHLP2020CZER1R5M11; Size / Dimension: 0.216" L x 0.204" W x 0.118" H (5.49mm x 5.18mm x 3.00mm); Package / Case: Non Standard; Material - Core: -; RoHS: RoHS Compliant
Q1 = CMP-078-0043-2: MOSFET P-CH 20V 35A PPK; Manufacturer: Vishay Siliconix; Manufacturer Part Number: SI7615ADN-T1-GE3; FET Type: MOSFET P-Channel, Metal Oxide; FET Feature: Standard; Current - Continuous Drain (Id) @ 25°C: 35A (Tc); Rds On (Max) @ Id, Vgs: 4.4 mOhm @ 20A, 10V; Vgs(th) (Max) @ Id: 1.5V @ 250µA; Gate Charge (Qg) @ Vgs: 183nC @ 10V; Input Capacitance (Ciss) @ Vds: 5590pF @ 10V; Power - Max: 52W; RoHS: RoHS Compliant; Stock 1: 98451; Pricing 1: 1=0.73, 10=0.646, 25=0.6068, 100=0.4951, 250=0.45988, 500=0.3914, 1000=0.31312 (USD); Packaging: Cut Tape (CT); Part Status: Active; Drain to Source Voltage (Vdss): 20V; Operating Temperature: -55°C ~ 150°C (TJ); Mounting Type: Surface Mount; Package / Case: PowerPAK® 1212-8; Supplier Device Package: PowerPAK® 1212-8; ComponentLink1URL: http://www.vishay.com/docs/62667/si7615adn.pdf; ComponentLink1Description: http://www.vishay.com/docs/62667/si7615adn.pdf; Source: transistor_fet.SchLib; Design Item ID: PFET_SI7615ADN-T1
R1 R6 = CMP-126-0273-2: RES SMD 10K OHM 1% 1/10W 0603; Manufacturer Part Number: RC0603FR-0710KL; Manufacturer: Yageo; Resistance (Sortable): 10000; Power (Watts): 0.1W, 1/10W; Temperature Coefficient: ±100ppm/°C; Datasheets: http://www.yageo.com/documents/recent/PYu-RC_Group_51_RoHS_L_9.pdf; Image: //media.digikey.com/Renders/Yageo%20Renders/0603-(1608-Metric).jpg; Tolerance: ±1%; Operating Temperature: -55°C ~ 155°C
R2 = CMP-126-0450-2: RES SMD 470K OHM 1% 1/10W 0603; Manufacturer Part Number: RC0603FR-07470KL; Manufacturer: Yageo; Power (Watts): 0.1W, 1/10W; Resistance (Sortable): 470000; Temperature Coefficient: ±100ppm/°C; Tolerance: ±1%; Datasheets: http://www.yageo.com/documents/recent/PYu-RC_Group_51_RoHS_L_9.pdf; Image: //media.digikey.com/Renders/Yageo%20Renders/0603-(1608-Metric).jpg; Operating Temperature: -55°C ~ 155°C
R3 = CMP-126-0382-2: RES SMD 100K OHM 1% 1/10W 0603; Manufacturer Part Number: RC0603FR-07100KL; Manufacturer: Yageo; Power (Watts): 0.1W, 1/10W; Resistance (Sortable): 100000; Temperature Coefficient: ±100ppm/°C; Tolerance: ±1%; Datasheets: http://www.yageo.com/documents/recent/PYu-RC_Group_51_RoHS_L_9.pdf; Image: //media.digikey.com/Renders/Yageo%20Renders/0603-(1608-Metric).jpg; Operating Temperature: -55°C ~ 155°C
R4 = CMP-126-0400-2: RES SMD 150K OHM 1% 1/10W 0603; Manufacturer Part Number: RC0603FR-07150KL; Manufacturer: Yageo; Power (Watts): 0.1W, 1/10W; Resistance (Sortable): 150000; Temperature Coefficient: ±100ppm/°C; Tolerance: ±1%; Datasheets: http://www.yageo.com/documents/recent/PYu-RC_Group_51_RoHS_L_9.pdf; Image: //media.digikey.com/Renders/Yageo%20Renders/0603-(1608-Metric).jpg; Operating Temperature: -55°C ~ 155°C
R5 = CMP-126-0304-2: RES SMD 20K OHM 1% 1/10W 0603; Manufacturer Part Number: RC0603FR-0720KL; Manufacturer: Yageo; Resistance (Sortable): 20000; Power (Watts): 0.1W, 1/10W; Temperature Coefficient: ±100ppm/°C; Datasheets: http://www.yageo.com/documents/recent/PYu-RC_Group_51_RoHS_L_9.pdf; Image: //media.digikey.com/Renders/Yageo%20Renders/0603-(1608-Metric).jpg; Tolerance: ±1%; Operating Temperature: -55°C ~ 155°C
R7 = CMP-126-0273-2: RES SMD 10K OHM 1% 1/10W 0603; Manufacturer: Yageo; Manufacturer Part Number: RC0603FR-0710KL; Power (Watts): 0.1W, 1/10W; Resistance (Sortable): 10000; Resistance: 10 kΩ; Temperature Coefficient: ±100ppm/°C; Tolerance: ±1%; Datasheets: http://www.yageo.com/documents/recent/PYu-RC_Group_51_RoHS_L_9.pdf; Image: //media.digikey.com/Renders/Yageo%20Renders/0603-(1608-Metric).jpg; Operating Temperature: -55°C ~ 155°C
R8 = CMP-126-0467-2: RES SMD 680K OHM 1% 1/10W 0603; Manufacturer: Yageo; Manufacturer Part Number: RC0603FR-07680KL; Power (Watts): 0.1W, 1/10W; Resistance (Sortable): 680000; Temperature Coefficient: ±100ppm/°C; Operating Temperature: -55°C ~ 155°C; Image: //media.digikey.com/Renders/Yageo%20Renders/0603-(1608-Metric).jpg; Tolerance: ±1%; Datasheets: http://www.yageo.com/documents/recent/PYu-RC_Group_51_RoHS_L_9.pdf
R38 = CMP-126-0382-2: RES SMD 100K OHM 1% 1/10W 0603; Manufacturer: Yageo; Manufacturer Part Number: RC0603FR-07100KL; Power (Watts): 0.1W, 1/10W; Resistance (Sortable): 100000; Temperature Coefficient: ±100ppm/°C; Image: //media.digikey.com/Renders/Yageo%20Renders/0603-(1608-Metric).jpg; Operating Temperature: -55°C ~ 155°C; Tolerance: ±1%; Datasheets: http://www.yageo.com/documents/recent/PYu-RC_Group_51_RoHS_L_9.pdf
R39 = CMP-126-0394-2: RES SMD 130K OHM 1% 1/10W 0603; Manufacturer Part Number: RC0603FR-07130KL; Manufacturer: Yageo; Resistance (Sortable): 130000; Power (Watts): 0.1W, 1/10W; Temperature Coefficient: ±100ppm/°C; Tolerance: ±1%; Image: //media.digikey.com/Renders/Yageo%20Renders/0603-(1608-Metric).jpg; Operating Temperature: -55°C ~ 155°C; Datasheets: http://www.yageo.com/documents/recent/PYu-RC_Group_51_RoHS_L_9.pdf
U1 = CMP-047-0013-1: BUCKBOOST TPS63070RNM, RNM0015A; Manufacturer: Texas Instruments; Manufacturer Part Number: TPS63070RNMR; Quiescent Current: 50uA; Min Input Voltage: 2V; Max Input Voltage: 16V; Output Current: 2A; Switching Frequency: 2.4MHz; Topology: Buck-Boost; Number of Outputs: 1; Min Output Voltage: 2.5V; Max Output Voltage: 9V; Synchronous Rectifier: Yes; Output Type: Adjustable; Output Configuration: Positive; ComponentLink1Description: Datasheet Link; ComponentLink1URL: https://sps06.itg.ti.com/sites/KMS/crossdivteams/altium/docs/ComponentDatasheets/TPS63070_datasheet_23_April2015.pdf; Stock 1: 16230; Pricing 1: 1=2.67, 10=2.402, 100=1.9306, 500=1.5862, 1000=1.31428 (USD); Mount: Surface Mount; Case/Package: VQFN; Number of Pins: 15; Min Operating Temperature: -40°C; Max Operating Temperature: 125°C; Packaging: Tape and Reel; Lead Free: Lead Free; Design Item ID: TPS63070RNM; Source: ic_pmic.SchLib
U21 = CMP-047-0013-1: BUCKBOOST TPS63070RNM, RNM0015A; Manufacturer: Texas Instruments; Max Output Voltage: 9V; Number of Outputs: 1; Output Current: 2A; Max Input Voltage: 16V; Topology: Buck-Boost; Min Input Voltage: 2V; Synchronous Rectifier: Yes; Output Configuration: Positive; Switching Frequency: 2.4MHz; Output Type: Adjustable; Min Output Voltage: 2.5V; Quiescent Current: 50uA; Packaging: Tape and Reel; Pricing 1: 1=2.67, 10=2.402, 100=1.9306, 500=1.5862, 1000=1.31428 (USD); Max Operating Temperature: 125°C; Stock 1: 16230; Mount: Surface Mount; Number of Pins: 15; Source: ic_pmic.SchLib; Lead Free: Lead Free; Design Item ID: TPS63070RNM; Case/Package: VQFN; Min Operating Temperature: -40°C; ComponentLink1URL: https://sps06.itg.ti.com/sites/KMS/crossdivteams/altium/docs/ComponentDatasheets/TPS63070_datasheet_23_April2015.pdf; ComponentLink1Description: Datasheet Link

## Sheet Blink_Blink_Beep_Boop.SchDoc: External Indicators
size A4; SheetNumber: 5; SheetTotal: 6
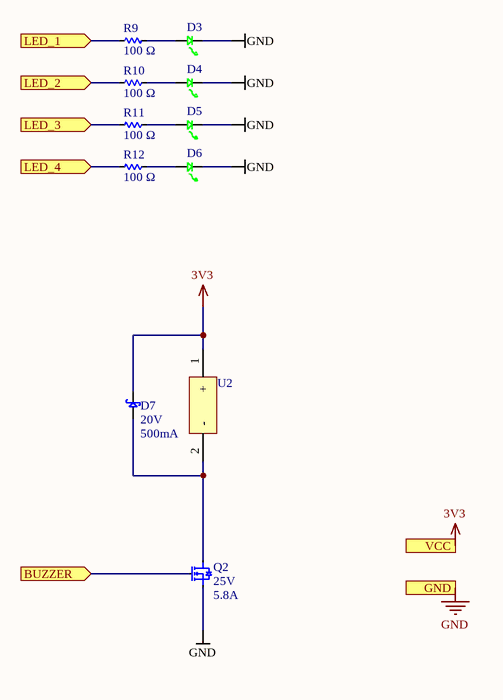
[diagram p3: Blink_Blink_Beep_Boop.SchDoc]

### Parts
D3  LED_LY971  [0805_Diode]  (value not drawn)
D4  LED_LY971  [0805_Diode]  (value not drawn)
D5  LED_LY971  [0805_Diode]  (value not drawn)
D6  LED_LY971  [0805_Diode]  (value not drawn)
D7  Voltage - DC Reverse (Vr) (Max): 20V  Current - Average Rectified (Io): 500mA  [SOD123]  (hidden comment: Symbol)
Q2  Drain to Source Voltage (Vdss): 25V  Current - Continuous Drain (Id) @ 25° C: 5.8A  [3SOT23]  (hidden comment: Symbol)
R9  Resistance: 100 Ω  [R0603]  (hidden comment: 311-100HRCT-ND)
R10  Resistance: 100 Ω  [R0603]  (hidden comment: 311-100HRCT-ND)
R11  Resistance: 100 Ω  [R0603]  (hidden comment: 311-100HRCT-ND)
R12  Resistance: 100 Ω  [R0603]  (hidden comment: 311-100HRCT-ND)
U2  BUZ_SMT-0540-T-7-R  [BUZ_SMT-0540-T-7-R]  (value not drawn)

### Ports
BUZZER (in), GND (in), LED_1 (in), LED_2 (in), LED_3 (in), LED_4 (in), VCC (in)

### Nets
3V3: D7.2 U2.1(+) ; port VCC
GND: D3.1 D4.1 D5.1 D6.1 Q2.2 ; port GND
BUZZER: Q2.1 ; port BUZZER
LED_1: R9.1 ; port LED_1
LED_2: R10.1 ; port LED_2
LED_3: R11.1 ; port LED_3
LED_4: R12.1 ; port LED_4
NetD3_2: D3.2 R9.2
NetD4_2: D4.2 R10.2
NetD5_2: D5.2 R11.2
NetD6_2: D6.2 R12.2
NetD7_1: D7.1 Q2.3 U2.2(-)

### Notes on the sheet
- Title
- Size:
- Date:
- A4
- Number:
- Time:
- Revision:
- Sheet
- of
- File:

### Library data of the parts
D3-D6 = CMP-033-0000-1: LED 0805 GREEN 20MA; Manufacturer: OSRAM Opto Semiconductors Inc; Manufacturer Part Number: LG R971-KN-1; Wavelength - Dominant: 570nm; Wavelength - Peak: 572nm; Millicandela Rating: 26.05mcd; Voltage - Forward (Vf) (Typ): 2.2V; Viewing Angle: 160°; Lens Transparency: Diffused; Lens Color: White; Lens Style/Size: Rectangle with Flat Top, 1.30mm x 1.25mm; RoHS: RoHS Compliant; Stock 1: 89733; Pricing 1: 1=0.08, 10=0.069, 100=0.0548, 250=0.04796, 500=0.04384 (USD); Packaging: Cut Tape (CT); Color: Green; Package / Case: 0805 (2012 Metric); Supplier Device Package: *; Size / Dimension: 2.00mm L x 1.25mm W; Height (Max): 0.80mm; Mounting Type: Surface Mount; ComponentLink1URL: http://www.osram-os.com/Graphics/XPic9/00078860_0.pdf; ComponentLink1Description: http://www.osram-os.com/Graphics/XPic9/00078860_0.pdf; Current - Test: 20mA; Design Item ID: LED_LY971; Source: diode.SchLib
D7 = CMP-033-0037-1: DIODE SCHOTTKY 0.5A 20V SOD-123; Manufacturer: Fairchild Semiconductor; Manufacturer Part Number: MBR0520L; Voltage - Forward (Vf) (Max) @ If: 385mV @ 500mA; Speed: Fast Recovery =< 500ns, > 200mA (Io); Current - Reverse Leakage @ Vr: 250µA @ 20V; RoHS: RoHS Compliant; Stock 1: 217232; Pricing 1: 1=0.63, 10=0.43, 100=0.2024, 250=0.1442, 500=0.11006, 750=0.08603, 1000=0.0759 (USD); Diode Type: Schottky; Reverse Recovery Time (trr): -; Capacitance @ Vr, F: -; Mounting Type: Surface Mount; Package / Case: SOD-123; Supplier Device Package: SOD-123; Packaging: Cut Tape (CT); ComponentLink1URL: http://www.fairchildsemi.com/ds/MB/MBR0520L.pdf; ComponentLink1Description: Datasheet; Design Item ID: SCHOTTKY_MBR0520L; Source: diode.SchLib
Q2 = CMP-078-0046-1: MOSFET N-CH 25V 5.8A SOT23; Manufacturer: International Rectifier; Manufacturer Part Number: IRFML8244TRPBF; FET Type: MOSFET N-Channel, Metal Oxide; FET Feature: Logic Level Gate; Rds On (Max) @ Id, Vgs: 24 mOhm @ 5.8A, 10V; Vgs(th) (Max) @ Id: 2.35V @ 10µA; Gate Charge (Qg) @ Vgs: 5.4nC @ 10V; Input Capacitance (Ciss) @ Vds: 430pF @ 10V; Power - Max: 1.25W; RoHS: RoHS Compliant; Stock 1: 13542; Pricing 1: 1=0.41, 10=0.23, 100=0.1491, 250=0.13548, 500=0.1219, 1000=0.11411 (USD); Mounting Type: Surface Mount; Package / Case: TO-236-3, SC-59, SOT-23-3; Supplier Device Package: SOT-23; Packaging: Cut Tape (CT); ComponentLink1URL: http://www.irf.com/product-info/datasheets/data/irfml8244pbf.pdf; ComponentLink1Description: Datasheet; Design Item ID: NFET_IRFML8244TRPBF; Source: transistor_fet.SchLib
R9-R12 = CMP-126-0070-2: RES SMD 100 OHM 1% 1/10W 0603; Manufacturer Part Number: RC0603FR-07100RL; Manufacturer: Yageo; Power (Watts): 0.1W, 1/10W; Resistance (Sortable): 100; Temperature Coefficient: ±100ppm/°C; Tolerance: ±1%; Datasheets: http://www.yageo.com/documents/recent/PYu-RC_Group_51_RoHS_L_9.pdf; Image: //media.digikey.com/Renders/Yageo%20Renders/0603-(1608-Metric).jpg; Operating Temperature: -55°C ~ 155°C
U2 = CMP-057-0027-1: Peak-Peak Signal Buzzer Single Tone 4kHz Magnetic 2 ~ 4V 78dB @ 3V, 10cm; Manufacturer: PUI Audio, Inc.; Driver Circuitry: Transducer, Externally Driven; Voltage Range: 2 ~ 4V; Current - Supply: 100mA; Port Location: Top; Manufacturer Part Number: SMT-0540-T-7-R; RoHS: RoHS Compliant; Stock 1: 12397; Pricing 1: 1=3.99, 10=3.325, 100=2.66, 500=2.3275 (USD); Packaging: Cut Tape (CT); Part Status: Active; Input Type: Peak-Peak Signal; Voltage - Rated: 3V; Frequency: 4kHz; Technology: Magnetic; Operating Mode: Single Tone; Duration: -; Sound Pressure Level: 78dB @ 3V, 10cm; Operating Temperature: -30°C ~ 70°C; Approvals: -; Ratings: -; Mounting Type: Surface Mount; Termination: Solder Pads; Size / Dimension: 5.0mm L x 5.0mm W x 2.1mm H; Height - Seated (Max): *; ComponentLink1URL: http://www.puiaudio.com/pdf/SMT-0540-T-7-R.pdf; ComponentLink1Description: http://www.puiaudio.com/pdf/SMT-0540-T-7-R.pdf; Design Item ID: BUZ_SMT-0540-T-7-R; Source: miscellaneous.SchLib